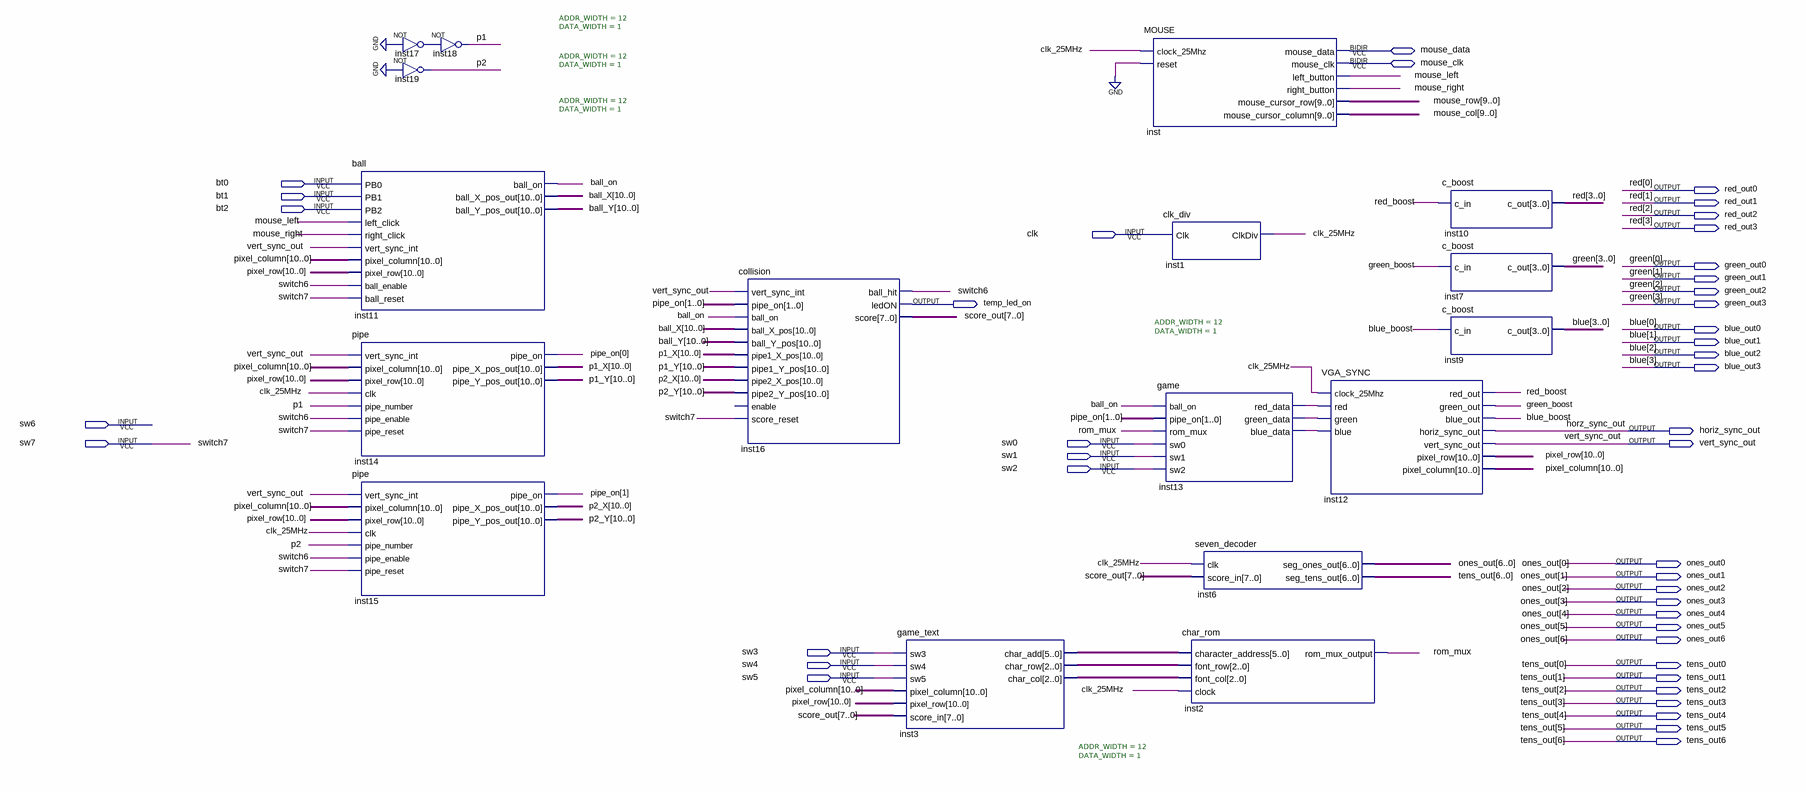
[diagram p0: schematic sheet]
// Quartus schematic Flappy.bdf as structural Verilog: 17 symbols, 43 pins
module Flappy (
  input  bt0,
  input  bt1,
  input  bt2,
  input  clk,
  input  sw6,
  input  sw7,
  input  sw0,
  input  sw1,
  input  sw2,
  input  sw3,
  input  sw4,
  input  sw5,
  inout  mouse_data,
  inout  mouse_clk,
  output red_out0,
  output red_out1,
  output red_out2,
  output red_out3,
  output green_out0,
  output green_out1,
  output green_out2,
  output temp_led_on,
  output green_out3,
  output blue_out0,
  output blue_out1,
  output blue_out2,
  output blue_out3,
  output horiz_sync_out,
  output vert_sync_out,
  output ones_out0,
  output ones_out1,
  output ones_out2,
  output ones_out3,
  output ones_out4,
  output ones_out5,
  output ones_out6,
  output tens_out0,
  output tens_out1,
  output tens_out2,
  output tens_out3,
  output tens_out4,
  output tens_out5,
  output tens_out6
);

  wire ball_on, blue_boost, clk_25MHz, green_boost, inst13_blue_data, inst13_green_data, inst13_red_data,
       inst17_out, mouse_left, mouse_right, p1, p2, red_boost, rom_mux, switch6;
  wire [1:0] pipe_on;
  wire [2:0] inst3_char_col, inst3_char_row;
  wire [5:0] inst3_char_add;
  wire [7:0] score_out;
  wire [9:0] mouse_col, mouse_row;
  wire [10:0] ball_X, ball_Y, p1_X, p1_Y, p2_X, p2_Y, pixel_column, pixel_row;

  ball #(.ADDR_WIDTH(12), .DATA_WIDTH(1)) inst11 (
    .PB0(bt0), .PB1(bt1), .PB2(bt2), .left_click(mouse_left), .right_click(mouse_right),
    .vert_sync_int(vert_sync_out), .pixel_column(pixel_column), .pixel_row(pixel_row), .ball_enable(switch6),
    .ball_reset(sw7), .ball_on(ball_on), .ball_X_pos_out(ball_X), .ball_Y_pos_out(ball_Y));
  pipe #(.ADDR_WIDTH(12), .DATA_WIDTH(1)) inst14 (
    .vert_sync_int(vert_sync_out), .pixel_column(pixel_column), .pixel_row(pixel_row), .clk(clk_25MHz),
    .pipe_number(p1), .pipe_enable(switch6), .pipe_reset(sw7), .pipe_on(pipe_on[0]), .pipe_X_pos_out(p1_X),
    .pipe_Y_pos_out(p1_Y));
  pipe #(.ADDR_WIDTH(12), .DATA_WIDTH(1)) inst15 (
    .vert_sync_int(vert_sync_out), .pixel_column(pixel_column), .pixel_row(pixel_row), .clk(clk_25MHz),
    .pipe_number(p2), .pipe_enable(switch6), .pipe_reset(sw7), .pipe_on(pipe_on[1]), .pipe_X_pos_out(p2_X),
    .pipe_Y_pos_out(p2_Y));
  not inst17 (inst17_out, 1'b0);
  not inst19 (p2, 1'b0);
  not inst18 (p1, inst17_out);
  collision inst16 (
    .vert_sync_int(vert_sync_out), .pipe_on(pipe_on), .ball_on(ball_on), .ball_X_pos(ball_X),
    .ball_Y_pos(ball_Y), .pipe1_X_pos(p1_X), .pipe1_Y_pos(p1_Y), .pipe2_X_pos(p2_X), .pipe2_Y_pos(p2_Y),
    .score_reset(sw7), .ball_hit(switch6), .ledON(temp_led_on), .score(score_out));  // open: enable
  game_text #(.ADDR_WIDTH(12), .DATA_WIDTH(1)) inst3 (
    .sw3(sw3), .sw4(sw4), .sw5(sw5), .pixel_column(pixel_column), .pixel_row(pixel_row),
    .score_in(score_out), .char_add(inst3_char_add), .char_row(inst3_char_row), .char_col(inst3_char_col));
  MOUSE inst (
    .clock_25Mhz(clk_25MHz), .reset(1'b0), .left_button(mouse_left), .right_button(mouse_right),
    .mouse_cursor_row(mouse_row), .mouse_cursor_column(mouse_col), .mouse_data(mouse_data),
    .mouse_clk(mouse_clk));
  clk_div inst1 (.Clk(clk), .ClkDiv(clk_25MHz));
  game #(.ADDR_WIDTH(12), .DATA_WIDTH(1)) inst13 (
    .ball_on(ball_on), .pipe_on(pipe_on), .rom_mux(rom_mux), .sw0(sw0), .sw1(sw1), .sw2(sw2),
    .red_data(inst13_red_data), .green_data(inst13_green_data), .blue_data(inst13_blue_data));
  char_rom inst2 (
    .character_address(inst3_char_add), .font_row(inst3_char_row), .font_col(inst3_char_col),
    .clock(clk_25MHz), .rom_mux_output(rom_mux));
  seven_decoder inst6 (
    .clk(clk_25MHz), .score_in(score_out),
    .seg_ones_out({ones_out6, ones_out5, ones_out4, ones_out3, ones_out2, ones_out1, ones_out0}),
    .seg_tens_out({tens_out6, tens_out5, tens_out4, tens_out3, tens_out2, tens_out1, tens_out0}));
  VGA_SYNC inst12 (
    .clock_25Mhz(clk_25MHz), .red(inst13_red_data), .green(inst13_green_data), .blue(inst13_blue_data),
    .red_out(red_boost), .green_out(green_boost), .blue_out(blue_boost), .horiz_sync_out(horiz_sync_out),
    .vert_sync_out(vert_sync_out), .pixel_row(pixel_row), .pixel_column(pixel_column));
  c_boost inst10 (.c_in(red_boost), .c_out({red_out3, red_out2, red_out1, red_out0}));
  c_boost inst7 (.c_in(green_boost), .c_out({green_out3, green_out2, green_out1, green_out0}));
  c_boost inst9 (.c_in(blue_boost), .c_out({blue_out3, blue_out2, blue_out1, blue_out0}));

  // Other names for the same wires on the sheet: blue[3:0] = {blue_out3, blue_out2, blue_out1, blue_out0};
  //   green[3:0] = {green_out3, green_out2, green_out1, green_out0}; horz_sync_out = horiz_sync_out;
  //   red[3:0] = {red_out3, red_out2, red_out1, red_out0}; switch7 = sw7
endmodule
